# Altium schematic sheet PS_RJ45.SchDoc: Ethernet From Processing System (PS) to RJ45 Interface
size A4; DocumentNumber: 10; SheetNumber: 10; SheetTotal: 16
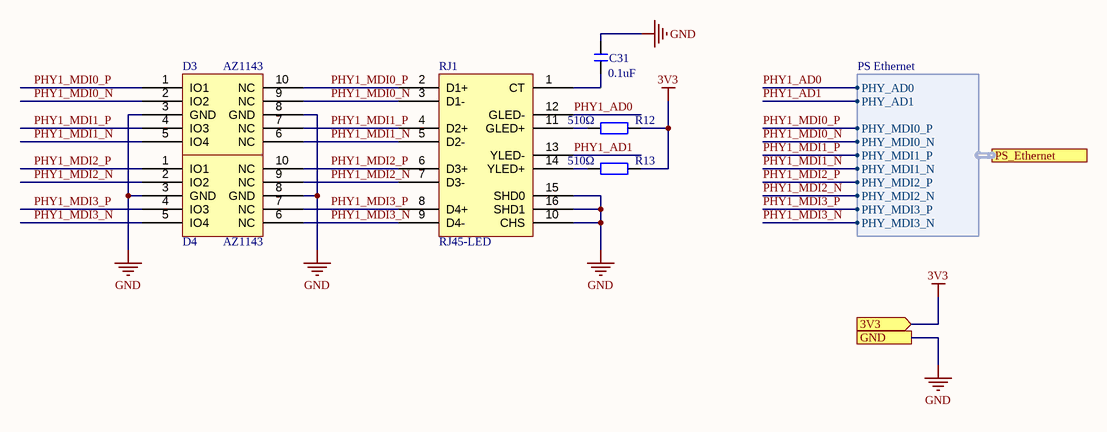
[diagram p0: PS_RJ45.SchDoc]

## Parts
C31  0.1uF  [C 0603_L]
D3  AZ1143  [DFN-10_L2.5-W1.0-P0.50-BL-A]
D4  AZ1143  [DFN-10_L2.5-W1.0-P0.50-BL-A]
R12  510Ω  [R 0603_L]
R13  510Ω  [R 0603_L]
RJ1  RJ45-LED  [RJ-45A16]

## Ports
3V3 (in), GND, PS_Ethernet (harness PS Ethernet)

## Harnesses
PS Ethernet: PHY_AD0, PHY_AD1, PHY_MDI0_P, PHY_MDI0_N, PHY_MDI1_P, PHY_MDI1_N, PHY_MDI2_P, PHY_MDI2_N, PHY_MDI3_P, PHY_MDI3_N

## Nets
3V3: R12.2 R13.2 ; port 3V3
GND: C31.2 D3.3(GND) D3.8(GND) D4.3(GND) D4.8(GND) RJ1.10(CHS) RJ1.15(SHD0) RJ1.16(SHD1) ; port GND
PHY1_AD0: RJ1.12(GLED-) ; port PS_Ethernet.PHY_AD0
PHY1_AD1: RJ1.13(YLED-) ; port PS_Ethernet.PHY_AD1
PHY1_MDI0_N: D3.2(IO2) D3.9(NC) RJ1.3(D1-) ; port PS_Ethernet.PHY_MDI0_N
PHY1_MDI0_P: D3.1(IO1) D3.10(NC) RJ1.2(D1+) ; port PS_Ethernet.PHY_MDI0_P
PHY1_MDI1_N: D3.5(IO4) D3.6(NC) RJ1.5(D2-) ; port PS_Ethernet.PHY_MDI1_N
PHY1_MDI1_P: D3.4(IO3) D3.7(NC) RJ1.4(D2+) ; port PS_Ethernet.PHY_MDI1_P
PHY1_MDI2_N: D4.2(IO2) D4.9(NC) RJ1.7(D3-) ; port PS_Ethernet.PHY_MDI2_N
PHY1_MDI2_P: D4.1(IO1) D4.10(NC) RJ1.6(D3+) ; port PS_Ethernet.PHY_MDI2_P
PHY1_MDI3_N: D4.5(IO4) D4.6(NC) RJ1.9(D4-) ; port PS_Ethernet.PHY_MDI3_N
PHY1_MDI3_P: D4.4(IO3) D4.7(NC) RJ1.8(D4+) ; port PS_Ethernet.PHY_MDI3_P
NetC31_1: C31.1 RJ1.1(CT)
NetR12_1: R12.1 RJ1.11(GLED+)
NetR13_1: R13.1 RJ1.14(YLED+)

## Notes on the sheet
- Title
- FileName:
- Version:
- Date:
- Project
- Designed By:
- Descriptions:
- Sheet:
- of

## Library data of the parts
C31 = C: 贴片电容; BOM名称: 无极性贴片电容; 淘宝ID: 封装库来自淘宝 ID：黄晶宝石; 联系售后，技术支持: https://shop463601444.taobao.com; 唯一出售店铺网址: https://shop463601444.taobao.com
D3 D4 = AZ1143: Transient Voltage Suppression (TVS) Diode
R12 R13 = R: 贴片电阻; 版权归属: 来自淘宝 ID：黄晶宝石; 封装库来自淘宝卖家 ID：黄晶宝石: 其他店铺购入均为盗版，不享受售后技术支持服务，请立即申请退款; BOM名称: 贴片电阻; 联系售后: https://shop463601444.taobao.com
RJ1 = RJ45-2LED: 带灯以太网接口; 版权归属: 封装库来自淘宝 ID：黄晶宝石; BOM名称: 带灯以太网接口; 学习资源: https://shop463601444.taobao.com